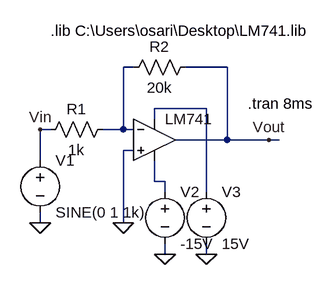
[diagram p0: schematic devre.asc]
devre.asc, the LTspice schematic file:
Version 4
SHEET 1 880 680
WIRE 96 96 80 96
WIRE 240 96 176 96
WIRE 208 160 128 160
WIRE 128 176 128 160
WIRE -32 192 -48 192
WIRE 80 192 80 96
WIRE 80 192 48 192
WIRE 96 192 80 192
WIRE 240 208 240 96
WIRE 240 208 160 208
WIRE 304 208 240 208
WIRE 320 208 304 208
WIRE 96 224 80 224
WIRE -48 240 -48 192
WIRE 128 272 128 240
WIRE 144 272 128 272
WIRE 144 288 144 272
WIRE 208 288 208 160
WIRE -48 336 -48 320
WIRE 80 336 80 224
WIRE 144 384 144 368
WIRE 208 384 208 368
FLAG -48 336 0
FLAG 80 336 0
FLAG 144 384 0
FLAG 208 384 0
FLAG -48 192 Vin
FLAG 304 208 Vout
SYMBOL voltage -48 224 R0
WINDOW 123 0 0 Left 0
WINDOW 39 0 0 Left 0
SYMATTR InstName V1
SYMATTR Value SINE(0 1 1k)
SYMBOL res 64 176 R90
WINDOW 0 0 56 VBottom 2
WINDOW 3 32 56 VTop 2
SYMATTR InstName R1
SYMATTR Value 1k
SYMBOL res 192 80 R90
WINDOW 0 0 56 VBottom 2
WINDOW 3 32 56 VTop 2
SYMATTR InstName R2
SYMATTR Value 20k
SYMBOL voltage 144 272 R0
WINDOW 123 0 0 Left 0
WINDOW 39 0 0 Left 0
SYMATTR InstName V2
SYMATTR Value -15V
SYMBOL voltage 208 272 R0
WINDOW 123 0 0 Left 0
WINDOW 39 0 0 Left 0
SYMATTR InstName V3
SYMATTR Value 15V
SYMBOL OpAmps\\UniversalOpamp2 128 208 R0
SYMATTR InstName LM741
TEXT -32 40 Left 2 !.lib C:\\Users\\osari\\Desktop\\LM741.lib
TEXT 272 152 Left 2 !.tran 8ms

The netlist it stands for:
* devre.asc
V1 Vin 0 SINE(0 1 1k)
R1 N001 Vin 1k
R2 Vout N001 20k
V2 N003 0 -15V
V3 N002 0 15V
XLM741 0 N001 N002 N003 Vout level.2 Avol=1Meg GBW=10Meg Slew=10Meg ilimit=25m rail=0 Vos=0 phimargin=45 en=0 enk=0 in=0 ink=0 Rin=500Meg  ; pins IN+ IN- V+ V- OUT
.lib C:\Users\osari\Desktop\LM741.lib
.tran 8ms
.lib UniversalOpamps2.sub
.backanno
.end